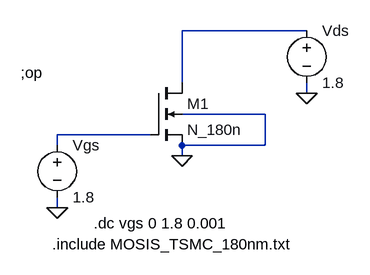
[diagram p0: schematic simulation.asc]
simulation.asc, the LTspice schematic file:
Version 4
SHEET 1 880 680
WIRE 224 -32 32 -32
WIRE 32 48 32 -32
WIRE 224 64 224 48
WIRE 160 96 32 96
WIRE -16 128 -160 128
WIRE -160 144 -160 128
WIRE 160 144 160 96
WIRE 160 144 32 144
WIRE 32 160 32 144
WIRE -160 240 -160 224
FLAG 224 64 0
FLAG 32 160 0
FLAG -160 240 0
SYMBOL nmos4 -16 48 R0
SYMATTR InstName M1
SYMATTR Value N_180n
SYMATTR Value2 l=180e-9 w=360e-9
SYMBOL voltage -160 128 R0
SYMATTR InstName Vgs
SYMATTR Value 1.8
SYMBOL voltage 224 -48 R0
SYMATTR InstName Vds
SYMATTR Value 1.8
TEXT -168 296 Left 2 !.include MOSIS_TSMC_180nm.txt
TEXT -216 32 Left 2 !;op
TEXT -104 264 Left 2 !.dc vgs 0 1.8 0.001

The netlist it stands for:
* simulation.asc
M1 N001 N002 0 0 N_180n l=180e-9 w=360e-9
Vgs N002 0 1.8
Vds N001 0 1.8
.model NMOS NMOS
.model PMOS PMOS
.lib standard.mos
.include MOSIS_TSMC_180nm.txt
;op
.dc vgs 0 1.8 0.001
.backanno
.end